# Altium schematic sheet Speaker_out.SchDoc: =DocumentName
size A4; CompanyName: "AS Manufacturing" LLC; Organization: "AS Manufacturing" LLC; Address1: 5 Sklyarenka St.; Address2: Kyiv 04073; Address3: Ukraine; Address4: https://ajax.systems/en/; SheetNumber: 2; SheetTotal: 11; Template_version: 1.0.1
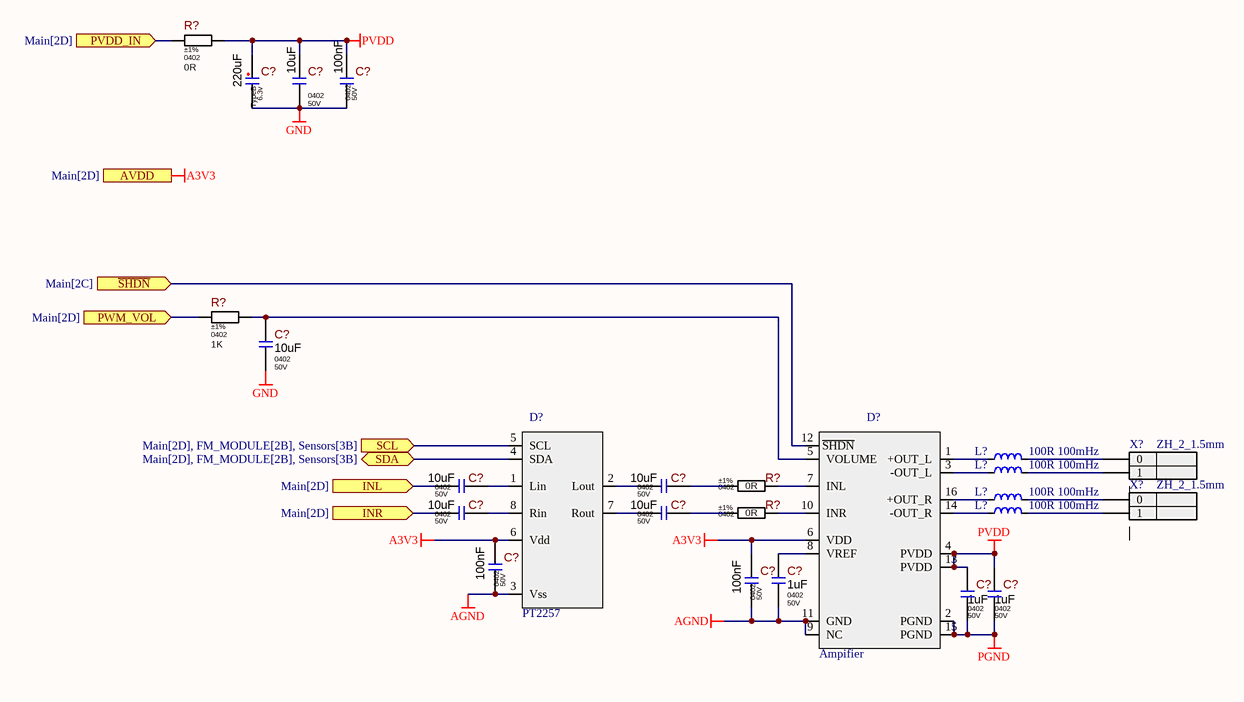
[diagram p0: Speaker_out.SchDoc]

## Parts
(Parts that share a designator on the sheet are numbered #1, #2 ... from top to bottom, then left to right.)
C?#1  Package: TypeB  Voltage: 6.3v  [Tantalum TYPE-B]  (hidden comment: 220uF)
C?#2  Package: 0402  Voltage: 50V  [Cap_0402]  (hidden comment: 10uF)
C?#3  Package: 0402  Voltage: 50V  [Cap_0402]  (hidden comment: 100nF)
C?#4  Package: 0402  Voltage: 50V  [Cap_0402]  (hidden comment: 10uF)
C?#5  Package: 0402  Voltage: 50V  [Cap_0402]  (hidden comment: 10uF)
C?#6  Package: 0402  Voltage: 50V  [Cap_0402]  (hidden comment: 10uF)
C?#7  Package: 0402  Voltage: 50V  [Cap_0402]  (hidden comment: 10uF)
C?#8  Package: 0402  Voltage: 50V  [Cap_0402]  (hidden comment: 10uF)
C?#9  Package: 0402  Voltage: 50V  [Cap_0402]  (hidden comment: 100nF)
C?#10  Package: 0402  Voltage: 50V  [Cap_0402]  (hidden comment: 100nF)
C?#11  Package: 0402  Voltage: 50V  [Cap_0402]  (hidden comment: 1uF)
C?#12  Package: 0402  Voltage: 50V  [Cap_0402]  (hidden comment: 1uF)
C?#13  Package: 0402  Voltage: 50V  [Cap_0402]  (hidden comment: 1uF)
D?#1  PT2257  [SOP8]
D?#2  Ampifier  [SOP16]
L?#1  100R 100mHz  [Cap_0805]
L?#2  100R 100mHz  [Cap_0805]
L?#3  100R 100mHz  [Cap_0805]
L?#4  100R 100mHz  [Cap_0805]
R?#1  value 0R  Tolerance: ±1%  Package: 0402  [Res_0402]  (hidden comment: Res_0402_0R)
R?#2  value 1K  Tolerance: ±1%  Package: 0402  [Res_0402]  (hidden comment: Res_0402_1K)
R?#3  value 0R  Tolerance: ±1%  Package: 0402  [Res_0402]  (hidden comment: Res_0402_0R)
R?#4  value 0R  Tolerance: ±1%  Package: 0402  [Res_0402]  (hidden comment: Res_0402_0R)
X?#1  ZH_2_1.5mm  [ZH_2_1.5mm]
X?#2  ZH_2_1.5mm  [ZH_2_1.5mm]

## Ports
AVDD (in, see Main[2D]), INL (in, see Main[2D]), INR (in, see Main[2D]), PVDD_IN (in, see Main[2D]), PWM_VOL (in, see Main[2D]), SCL (in, see Main[2D], FM_MODULE[2B], Sensors[3B]), SDA (bidir, see Main[2D], FM_MODULE[2B], Sensors[3B]), ~{SHDN} (in, see Main[2C])

## Nets
A3V3: C?#9.1 C?#10.1 D?#1.6(Vdd) D?#2.6(VDD) ; port AVDD
AGND: C?#9.2 C?#10.2 C?#11.2 D?#1.3(Vss) D?#2.9(NC) D?#2.11(GND)
GND: C?#1.2 C?#2.2 C?#3.2 C?#4.2
PGND: C?#12.2 C?#13.2 D?#2.2(PGND) D?#2.15(PGND)
PVDD: C?#1.1 C?#2.1 C?#3.1 C?#12.1 C?#13.1 D?#2.4(PVDD) D?#2.13(PVDD) R?#1.2
INL: C?#5.1 ; port INL
INR: C?#7.1 ; port INR
PVDD_IN: R?#1.1 ; port PVDD_IN
PWM_VOL: R?#2.1 ; port PWM_VOL
~{SHDN}: D?#2.12(~{SHDN}) ; port ~{SHDN}
SCL: D?#1.5(SCL) ; port SCL
SDA: D?#1.4(SDA) ; port SDA
NetC?#4_1: C?#4.1 D?#2.5(VOLUME) R?#2.2
NetC?#5_2: C?#5.2 D?#1.1(Lin)
NetC?#6_1: C?#6.1 D?#1.2(Lout)
NetC?#6_2: C?#6.2 R?#3.1
NetC?#7_2: C?#7.2 D?#1.8(Rin)
NetC?#8_1: C?#8.1 D?#1.7(Rout)
NetC?#8_2: C?#8.2 R?#4.1
NetC?#11_1: C?#11.1 D?#2.8(VREF)
NetD?#2_1: D?#2.1(+OUT_L) L?#1.1
NetD?#2_3: D?#2.3(-OUT_L) L?#2.1
NetD?#2_7: D?#2.7(INL) R?#3.2
NetD?#2_10: D?#2.10(INR) R?#4.2
NetD?#2_14: D?#2.14(-OUT_R) L?#4.1
NetD?#2_16: D?#2.16(+OUT_R) L?#3.1
NetL?#1_2: L?#1.2 X?#1.0
NetL?#2_2: L?#2.2 X?#1.1
NetL?#3_2: L?#3.2 X?#2.0
NetL?#4_2: L?#4.2 X?#2.1

## Notes on the sheet
- Title
- Product:
- Project:
- Size:
- Date:
- Variant:
- A4
- Authors:
- Time:
- Sheet
- of
- Rev:
- Commit:

## Library data of the parts
C?#1 = Cap_TypeB_220uF: Tantalum_TYPE-B 220uF 6.3V; Tolerance: ±25%; ComponentLink1URL: https://search.murata.co.jp/Ceramy/image/img/A01X/G101/ENG/GRM31CR60J107ME39-01.pdf; ComponentLink1Description: Datasheet; Component Type: SMD; Value: 220uF
C?#2 C?#4-C?#8 = Cap_0402_10uF: 10uF 50V  ±25% 0402 Ceramic Capacitor; Component Type: SMD; Tolerance: ±25%; ComponentLink1URL: https://search.murata.co.jp/Ceramy/image/img/A01X/G101/ENG/GRM31CR60J107ME39-01.pdf; ComponentLink1Description: Datasheet; Value: 10uF
C?#3 C?#9 C?#10 = Cap_0402_100nF: 100nF 50V  ±25% 0402 Ceramic Capacitor; Component Type: SMD; Tolerance: ±25%; ComponentLink1URL: https://search.murata.co.jp/Ceramy/image/img/A01X/G101/ENG/GRM31CR60J107ME39-01.pdf; ComponentLink1Description: Datasheet; Value: 100nF
C?#11-C?#13 = Cap_0402_1uF: 1uF 50V  ±25% 0402 Ceramic Capacitor; Component Type: SMD; Tolerance: ±25%; ComponentLink1URL: https://search.murata.co.jp/Ceramy/image/img/A01X/G101/ENG/GRM31CR60J107ME39-01.pdf; ComponentLink1Description: Datasheet; Value: 1uF
D?#1 = PT2257: Digital potentiometr
D?#2 = PAM8003: Amplifier 2.5W class-d stereo / 64-Step DC Volume Control
L?#1-L?#4 = FerriteBead_0805_100R_100Mhz_1
R?#1 R?#3 R?#4 = Res_0402_0R: ±1% 1/16W 0402; Power Rating: 0.062W; Voltage: 50V; ComponentLink1URL: https://www.yageo.com/upload/media/product/productsearch/datasheet/rchip/PYu-RC_Group_51_RoHS_L_10.pdf; ComponentLink1Description: Datasheet
R?#2 = Res_0402_1K: ±1% 1/16W 0402; Power Rating: 0.062W; Voltage: 50V; ComponentLink1URL: https://www.yageo.com/upload/media/product/productsearch/datasheet/rchip/PYu-RC_Group_51_RoHS_L_10.pdf; ComponentLink1Description: Datasheet